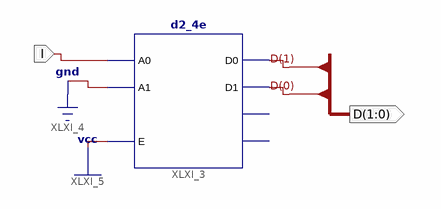
[diagram p0: schematic sheet 1]
// Xilinx ISE schematic decooder2_1.sch (spartan6) as structural Verilog: 1 symbols, 2 ports
module decooder2_1 (
  input  I,
  output [1:0] D
);

  d2_4e XLXI_3 (.A0(I), .A1(1'b0), .E(1'b1), .D0(D[1]), .D1(D[0]));  // open: D2, D3
endmodule
